# Altium project ProjectY.PrjPcb
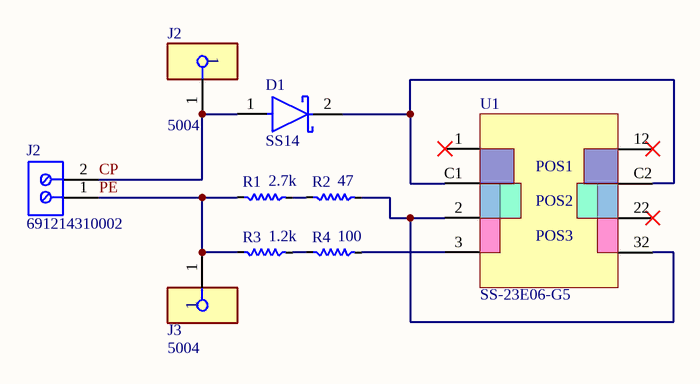
[diagram p0: Block_Diagram.SchDoc]
Autore: F.Moretti; azienda: Silla_industries; code_ID: ProjectY; codice_articolo_pcb: _; codice_scheda_montata: _; disegnato_da: F.Moretti; indirizzo: Descrizione; nome_progetto: ProjectX; PCBTS_Area: ## cm^2; PCBTS_CB: Not Allowed; PCBTS_CI: Not required; PCBTS_CTI: ###; PCBTS_Cut: VSCORING; PCBTS_DT: +/- 0.08mm (if not specified); PCBTS_ET: Requested; PCBTS_Finish: HASL; PCBTS_Finished_Cu: 35 um; PCBTS_laminate: FR4; PCBTS_Marks: Preferably Allowed on Soldermask Layers; PCBTS_Mod: Not Allowed; PCBTS_Nlayers: 2; PCBTS_Rails: 10 mm (see Panel Specification page); PCBTS_SB: Do not remove; PCBTS_Silk: Top+Bottom (White); PCBTS_SM: Top+Bottom (Green); PCBTS_TG: 130; PCBTS_Thickness: 1.6 +- 10%; PCBTS_Vendor_Logo: Not Allowed; PCBTS_VEP: Not required; revisione: 0; versione: A
1 sheet, 9 parts. Net scope: global (net labels, ports and power ports of the same name join across sheets).
Board files: Pannello_Vcut.PcbDoc, ProjectY_PCB.PcbDoc

## Sheet Block_Diagram.SchDoc: Modulo_Condensatori
size A4; ApprovedBy: S.King; CompanyName: DB Elettronica Telecomunicazioni SpA; Organization: DB Elettronica Telecomunicazioni SpA; Address1: Via Gaetano Bargnani, 7,; Address2: 25135; Address3: Brescia,; Address4: Italy; DocumentNumber: 1; Revision: 01; SheetNumber: 1; SheetTotal: 2

### Parts
(Parts that share a designator on the sheet are numbered #1, #2 ... from top to bottom, then left to right.)
D1  SS14  [FP-403AE-MFG]
J2#1  5004  [FP-5004-MFG]
J2#2  691214310002  [691214310002]
J3  5004  [FP-5004-MFG]
R1  2.7k  [RESC1608X05N]
R2  47  [RESC1608X05N]
R3  1.2k  [RESC1608X05N]
R4  100  [RESC1608X05N]
U1  SS-23E06-G5  [SS-23E06-G5]

### Nets
CP: D1.1(A) J2#1.1 J2#2.2
PE: J2#2.1 J3.1 R1.1 R3.1
NetD1_2: D1.2(C) U1.C1 U1.C2
NetR1_2: R1.2 R2.1
NetR2_2: R2.2 U1.2 U1.32
NetR3_2: R3.2 R4.1
NetR4_2: R4.2 U1.3

Not connected (* = marked no-connect by the designer): U1 1* 12* 22*

### Notes on the sheet
- Project:
- Sheet:
- PCBID:
- Ver:
- Rev:
- Variant:
- Size:
- A4
- Date:
- Time:
- of
- DrawnBy:
- ApprovedBy:
- (in symbol SS-23E06-G5) POS1; POS2; POS3

### Library data of the parts
D1 = CMP-2000-04943-2: DIODE SCHOTTKY 40V 1A SMA; Manufacturer: ON Semiconductor; Peak Reverse Current: 0.2mA; Max Junction Temp: +125°C; Standoff Height: 0.05mm; Max Surge Forward Current: 40A; Mouser Description: Schottky Diodes & Rectifiers SMA 40V 1.0A; RoHS: TRUE; Lead Free: Yes; Manufacturer Part Number: SS14; Device Class L3: Schottky Diodes; Category: Diode; Automotive: No; Digikey Description: DIODE SCHOTTKY 40V 1A SMA; ComponentLink2Description: Datasheet; Device Class L2: Diodes; Height: 2.5mm; Temperature Range High: +125°C; ComponentLink2URL: https://www.onsemi.com/pub/Collateral/SS19-D.PDF; Device Class L1: Discrete Semiconductors; Package: 403AE; Octopart: https://octopart.com/ss14-on+semiconductor-29205033; Max Repetitive Reverse Voltage: 40V; Temperature Range Low: -65°C; Forward Current: 1A; Temperature: -65°C to +125°C
J2#1 J3 = CMP-2000-05575-2: PC TEST POINT MINIATURE YELLOW; Manufacturer: Keystone; Number Of Contacts: 1; Is Female: yes; Device Class L1: Connectors; Manufacturer Part Number: 5004; Digikey Description: PC TEST POINT MINIATURE YELLOW; ComponentLink2URL: https://www.keyelco.com/product-pdf.cfm?p=1313; Lead Free: Yes; ComponentLink2Description: Datasheet; Category: Conn; Height: 4.72mm; Octopart: https://octopart.com/5004-keystone-28591; Mouser Description: TEST POINT PC MINI .040"D YELLOW; Device Class L3: unset; Contact Material: Silver; Package: 5004; Automotive: No; Device Class L2: unset; RoHS: TRUE
J2#2 = CMP-1502-02498-1: Serie 2143 - 3.81 mm Horizontal Cable Entry with Rising Cage Clamp WR-TBL, 2 pin; Manufacturer: Wurth Elektronik; Pin Number: 2; Pitch: 3.81mm; Publisher: WurthElektronik; Manufacturer URL: http://www.we-online.de; Operating Temperature: -40to105degC; Mounting Technology: THT; Packaging: Box; Package Reference: 691214310002; Part Number: 691214310002; Datasheet URL: http://katalog.we-online.de/em/datasheet/6912143100xx.pdf
R1-R4 = RES_0603: 22 kOhm 0603 1/4W SMD Resistor
U1 = SS-23E06-G5: High-Speed CAN Transceiver, / 1 Mb/s, 4.5 to 5.5 V, 8-Pin SOIC (SN), Industrial Temperature, RoHS, Tube; Manufacturer: Microchip; RoHSCompliant: true; PackageReference: SN8; ComponentLink1URL: http://www.microchip.com/; DatasheetVersion: Rev. F, 07/2010; ComponentLink2Description: Datasheet; ComponentLink2URL: http://ww1.microchip.com/downloads/en/DeviceDoc/21667f.pdf; ComponentLink3Description: Package Specification; PackageDescription: 8-Pin Small Outline Integrated Circuit, Body 4.9 x 3.9 mm, Pitch 1.27 mm; ComponentLink1Description: Manufacturer URL; Mounting Technology: Surface Mount; ComponentLink3URL: http://www.microchip.com/stellent/groups/techpub_sg/documents/packagingspec/en012702.pdf